# EAGLE design Tag PCB V1 (EAGLE 9.2.0)
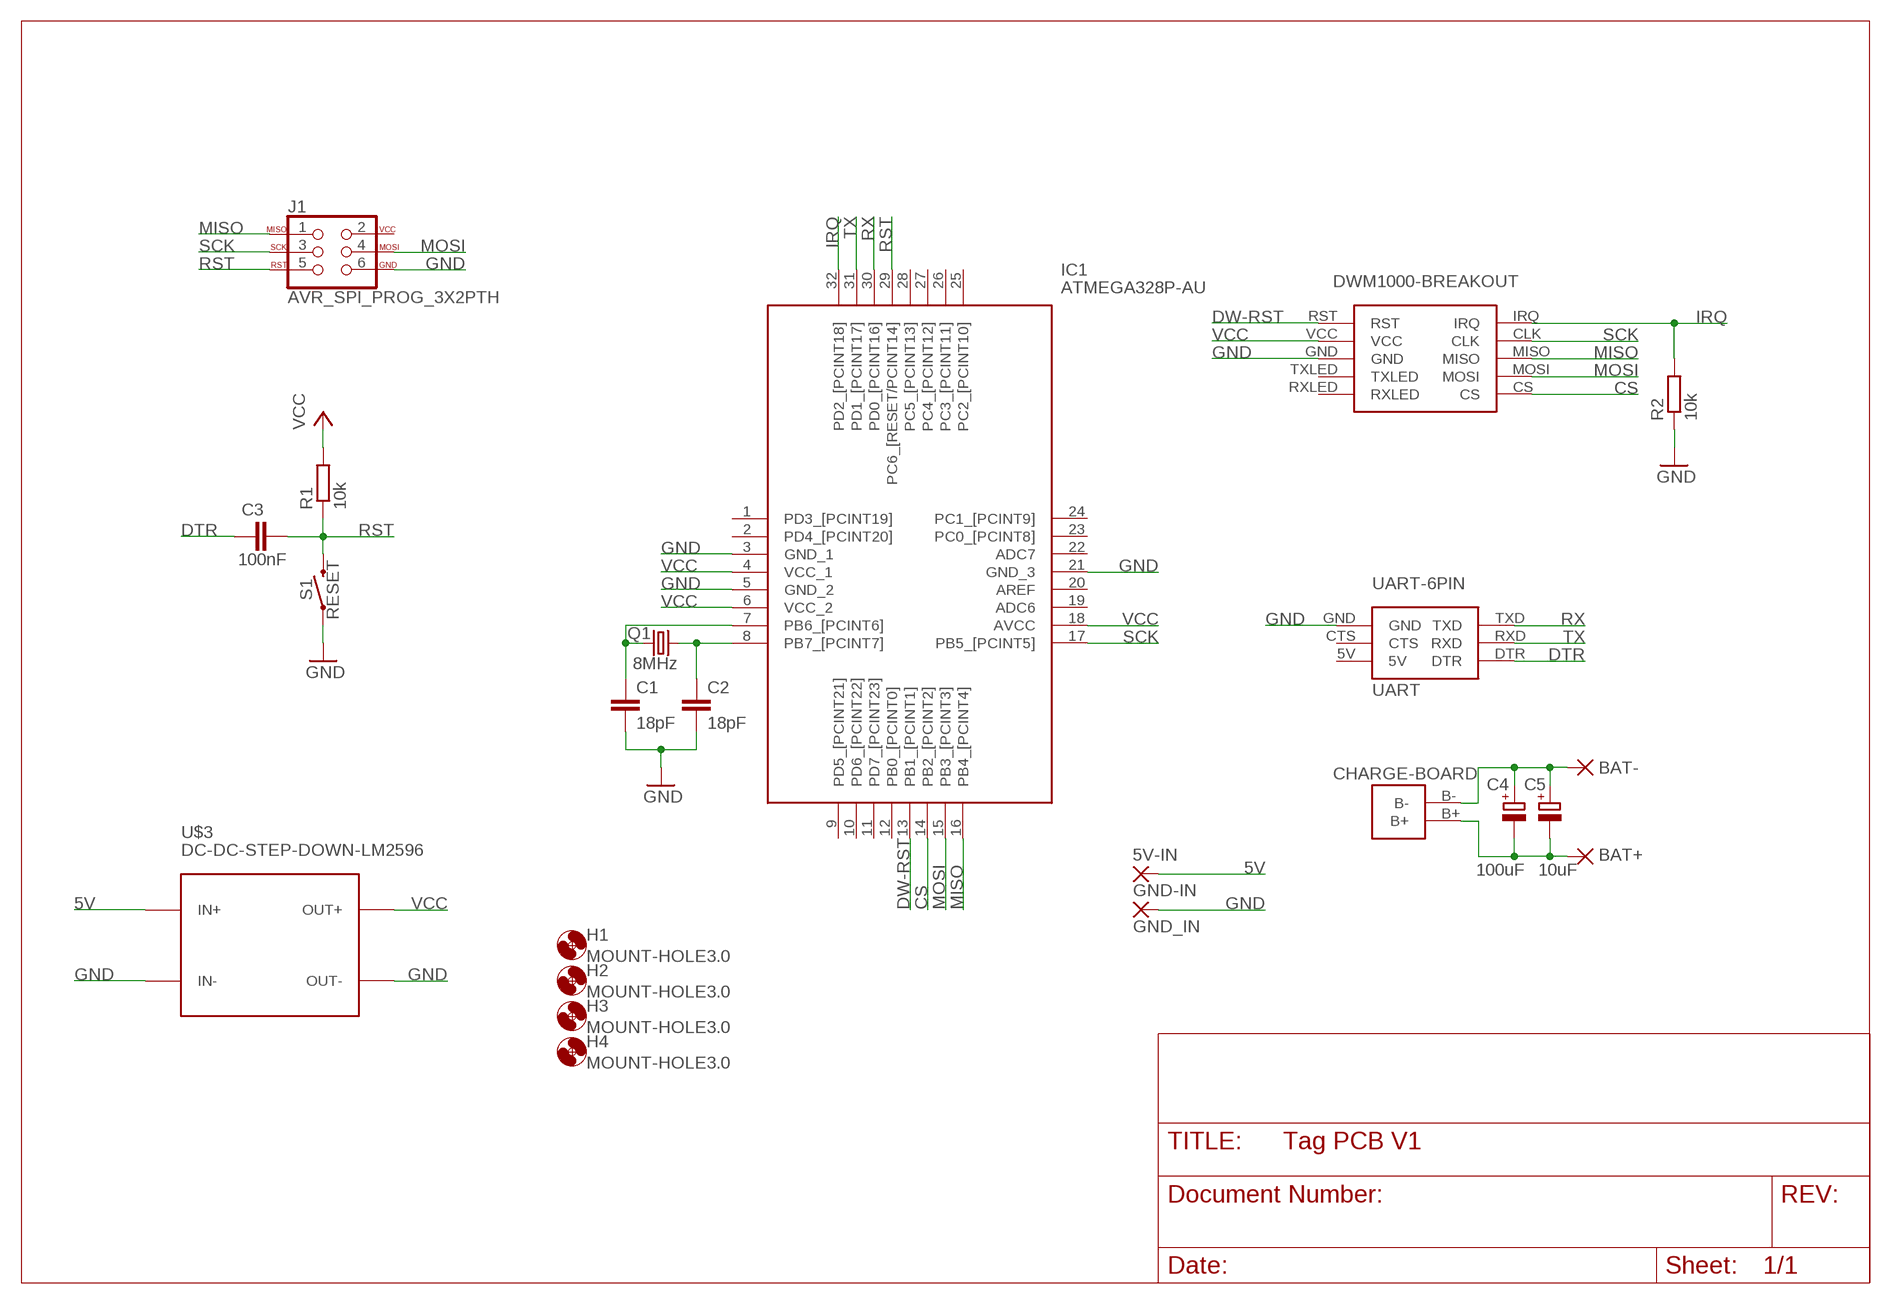
[diagram p0: schematic, sheet 1]

## Parts
5V-IN  2,15/1,0  [2,15/1,0]
BAT+  2,15/1,0  [2,15/1,0]
BAT-  2,15/1,0  [2,15/1,0]
C1  18pF  C-EUC0805  [C0805]
C2  18pF  C-EUC0805  [C0805]
C3  100nF  C-EUC0805  [C0805]
C4  100uF  CPOL-EUE3.5-8  [E3,5-8]
C5  10uF  CPOL-EUE2.5-7  [E2,5-7]
GND-IN  GND_IN  2,15/1,0  [2,15/1,0]
H1  MOUNT-HOLE3.0  [3,0]
H2  MOUNT-HOLE3.0  [3,0]
H3  MOUNT-HOLE3.0  [3,0]
H4  MOUNT-HOLE3.0  [3,0]
IC1  ATMEGA328P-AU  [QFP80P900X900X120-32N]
J1  AVR_SPI_PROG_3X2PTH  [2X3]
Q1  8MHz  CRYSTALHC49UP  [HC49UP]
R1  10k  R-EU_R0805  [R0805]
R2  10k  R-EU_R0805  [R0805]
S1  RESET  MOMENTARY-SWITCH-SPST-PTH-6.0MM  [TACTILE_SWITCH_PTH_6.0MM]
U$1  DWM1000-BREAKOUT  [DWM1000-BREAKOUT]
U$2  UART-6PIN  [UART-6PIN]
U$3  DC-DC-STEP-DOWN-LM2596  [DC-DC-STEP-DOWN-LM2596]
U$4  18650-CHARGE-5V-OUT  [18650-CHARGE-5V-OUT]

## Nets
5V: 5V-IN.1(P) U$3.IN+
CS: IC1.14(PB2_[PCINT2]) U$1.CS
DTR: C3.1 U$2.DTR
DW-RST: IC1.13(PB1_[PCINT1]) U$1.RST
GND: C1.2 C2.2 GND-IN.1(P) IC1.3(GND_1) IC1.5(GND_2) IC1.21(GND_3) J1.6 R2.1 S1.1 U$1.GND U$2.GND U$3.IN- U$3.OUT-
IRQ: IC1.32(PD2_[PCINT18]) R2.2 U$1.IRQ
MISO: IC1.16(PB4_[PCINT4]) J1.1 U$1.MISO
MOSI: IC1.15(PB3_[PCINT3]) J1.4 U$1.MOSI
N$1: BAT-.1(P) C4.+ C5.+ U$4.B-
N$2: BAT+.1(P) C4.- C5.- U$4.B+
N$5: C2.1 IC1.8(PB7_[PCINT7]) Q1.2
N$6: C1.1 IC1.7(PB6_[PCINT6]) Q1.1
RST: C3.2 IC1.29(PC6_[RESET/PCINT14]) J1.5 R1.1 S1.3
RX: IC1.30(PD0_[PCINT16]) U$2.TXD
SCK: IC1.17(PB5_[PCINT5]) J1.3 U$1.CLK
TX: IC1.31(PD1_[PCINT17]) U$2.RXD
VCC: IC1.4(VCC_1) IC1.6(VCC_2) IC1.18(AVCC) R1.2 U$1.VCC U$3.OUT+
Unconnected: IC1.1(PD3_[PCINT19]) IC1.2(PD4_[PCINT20]) IC1.9(PD5_[PCINT21]) IC1.10(PD6_[PCINT22]) IC1.11(PD7_[PCINT23]) IC1.12(PB0_[PCINT0]) IC1.19(ADC6) IC1.20(AREF) IC1.22(ADC7) IC1.23(PC0_[PCINT8]) IC1.24(PC1_[PCINT9]) IC1.25(PC2_[PCINT10]) IC1.26(PC3_[PCINT11]) IC1.27(PC4_[PCINT12]) IC1.28(PC5_[PCINT13]) J1.2 U$1.RXLED U$1.TXLED U$2.5V U$2.CTS

## Notes on the sheet
- CHARGE-BOARD

## Library data of the parts
5V-IN BAT+ BAT- GND-IN = wirepad:2,15/1,0: THROUGH-HOLE PAD
C1-C3 = rcl:C-EU: CAPACITOR, European symbol; SPICEPREFIX: C
C4 C5 = rcl:CPOL-EU: POLARIZED CAPACITOR, European symbol; SPICEPREFIX: C
H1-H4 = holes:MOUNT-HOLE: MOUNTING HOLE with drill center marker
IC1 = ATMEGA328P-AU:ATMEGA328P-AU: MICROCHIP - ATMEGA328P-AU. - MICROCONTROLLER MCU, 8 BIT, ATMEGA, 20MHZ, TQFP-32 Source: Datasheet <https://componentsearchengine.com/Datasheets/2/ATMEGA328P-AU.pdf>; ARROW_PART_NUMBER: ATMEGA328P-AU; ARROW_PRICE-STOCK: https://www.arrow.com/en/products/atmega328p-au/microchip-technology; DESCRIPTION: MICROCHIP - ATMEGA328P-AU. - MICROCONTROLLER MCU, 8 BIT, ATMEGA, 20MHZ, TQFP-32; HEIGHT: 1.2mm; MANUFACTURER_NAME: Microchip; MANUFACTURER_PART_NUMBER: ATMEGA328P-AU; RS_PART_NUMBER: 1310271; RS_PRICE-STOCK: http://uk.rs-online.com/web/p/products/1310271
J1 = SparkFun-Connectors:AVR_SPI_PROG_3X2: AVR ISP 6 Pin This is the reduced ISP connector for AVR programming. Common on Arduino. This footprint will take up less PCB space and can be used with a 10-pin to 6-pin adapter such as SKU: BOB-08508 **Special note about "TEST_POINT" package. The stop mask is on the top side, so if you want your programming test points to be on the bottom of your board, make sure to place this package on the bottom side of the board. This also ensure that the orientation to program from the bottom side will be correct. SparkFun Products: SparkFun ISP Pogo Adapter <https://www.sparkfun.com/products/11591> - NS Tiny AVR Programmer <https://www.sparkfun.com/products/11801> -PTH
Q1 = crystal:CRYSTAL: CRYSTAL; OC_FARNELL: unknown; OC_NEWARK: unknown
R1 R2 = rcl:R-EU_: RESISTOR, European symbol; SPICEPREFIX: R
S1 = SparkFun-Switches:MOMENTARY-SWITCH-SPST: Momentary Switch (Pushbutton) - SPST Normally-open (NO) SPST momentary switches (buttons, pushbuttons). Variants PTH-12MM - 12mm square, through-hole Momentary Pushbutton Switch - 12mm Square <https://www.sparkfun.com/products/9190> (COM-09190) PTH-6.0MM, PTH-6.0MM-KIT - 6.0mm square, through-hole Mini Pushbutton Switch <https://www.sparkfun.com/products/97> (COM-00097) KIT package intended for soldering kit's - only one side of pads' copper is exposed. PTH-RIGHT-ANGLE-KIT - Right-angle, through-hole Right Angle Tactile Button <https://www.sparkfun.com/products/10791> - Used on SparkFun BigTime Watch Kit <https://www.sparkfun.com/products/11734> SMD-12MM - 12mm square, surface-mount Tactile Button - SMD (12mm) <https://www.sparkfun.com/products/12993> (COM-12993) Used on SparkFun PicoBoard <https://www.sparkfun.com/products/11888> SMD-4.5MM - 4.5mm Square Trackball Switch Used on SparkFun Blackberry Trackballer Breakout <https://www.sparkfun.com/products/13169> SMD-4.6MMX2.8MM - 4.60mm x 2.80mm, surface mount Used on SparkFun SAMD21 Mini Breakout <https://www.sparkfun.com/products/13664> SMD-5.2MM, SMD-5.2-REDUNDANT - 5.2mm square, surface-mount Mini Pushbutton Switch - SMD <https://www.sparkfun.com/products/8720> (COM-08720) Used on Arduino Pro Mini <https://www.sparkfun.com/products/11114> REDUNDANT package connects both switch circuits together SMD-6.0X3.5MM - 6.0 x 3.5mm, surface mount Momentary Reset Switch SMD <https://www.sparkfun.com/products/8229> (COM-08229) SMD-6.2MM-TALL - 6.2mm square, surface mount Tactile Button - SMD (6mm) <https://www.sparkfun.com/products/12992> Used on SparkFun Digital Sandbox <https://www.sparkfun.com/products/12651> SMD-RIGHT-ANGLE - Right-angle, surface mount Used on SparkFun Block for Intel® Edison - Arduino <https://www.sparkfun.com/products/13036>; PROD_ID: SWCH-08441; SF_SKU: COM-00097
U$1 = Eigen Library:DWM1000-BREAKOUT
U$2 = Eigen Library:UART-6PIN
U$3 = 1484249208697-powermodules:DC-DC-STEP-DOWN-LM2596: DC/DC Step-Down Regulator based on LM2596-ADJ chip
U$4 = Eigen Library:18650-CHARGE-5V-OUT

## Board
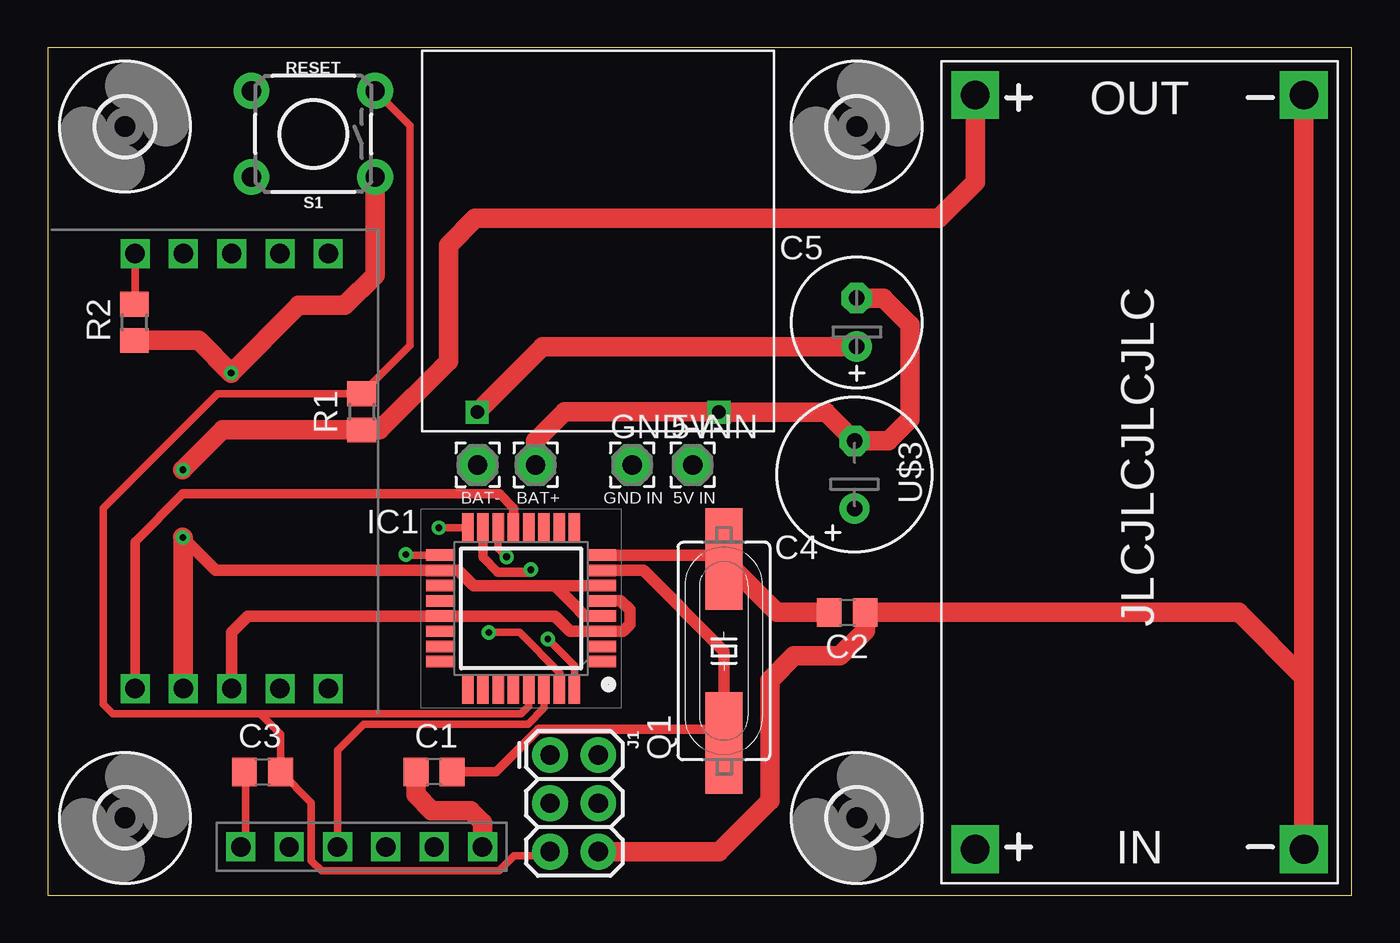
[diagram p1: board, top side]
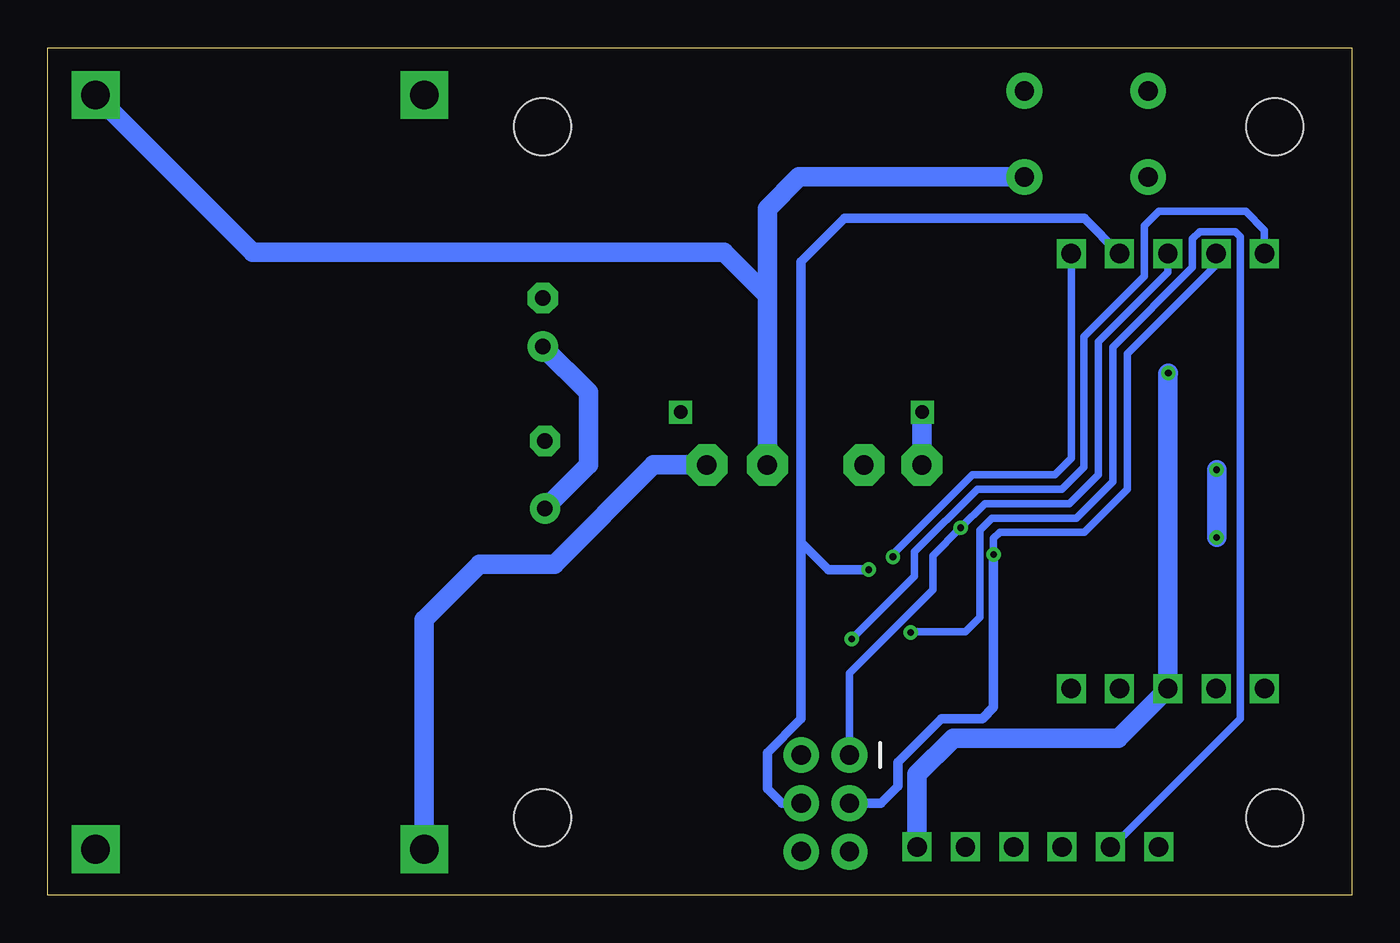
[diagram p2: board, bottom side, seen from below]

Size 68.57 x 44.54 mm. Coordinates in mm from the lower left corner, seen from the top.
Outline: 0,0 68.57,0 68.57,44.54 0,44.54 0,0
Copper layers (1*16): Top 0.035mm / dielectric 1.5mm / Bottom 0.035mm
Design rules "default *": minimum track width 15mil, minimum drill 0.35mm, track to track 6mil, track to pad 6mil, pad to pad 6mil, via to via 6mil, smd to smd 6mil, copper to edge 40mil, drill to drill 6mil, minimum pad ring 10mil, minimum via ring 8mil, stop-mask expansion 4mil, vias tented up to drill 0mil, thermal gap 10mil

### Footprints (pad centres in the part's own frame; a part is rotated, then mirrored left to right if it is on the bottom)
2,15/1,0 = drill 1.016 pad 2.159 octagon: 1 0,0
C0805 = smd 1.3 x 1.5: 1 -0.95,0; 2 0.95,0
E3,5-8 = drill 0.813 pad 1.6: + -1.778,0 | drill 0.813 pad 1.6 octagon: - 1.778,0
E2,5-7 = drill 0.813 pad 1.6: + -1.27,0 | drill 0.813 pad 1.6 octagon: - 1.27,0
3,0 = hole 3: 0,0
QFP80P900X900X120-32N = smd 1.5 x 0.6: 1 -4.25,2.8; 2 -4.25,2; 3 -4.25,1.2; 4 -4.25,0.4; 5 -4.25,-0.4; 6 -4.25,-1.2; 7 -4.25,-2; 8 -4.25,-2.8; 17 4.25,-2.8; 18 4.25,-2; 19 4.25,-1.2; 20 4.25,-0.4; 21 4.25,0.4; 22 4.25,1.2; 23 4.25,2; 24 4.25,2.8 | smd 0.6 x 1.5: 9 -2.8,-4.25; 10 -2,-4.25; 11 -1.2,-4.25; 12 -0.4,-4.25; 13 0.4,-4.25; 14 1.2,-4.25; 15 2,-4.25; 16 2.8,-4.25; 25 2.8,4.25; 26 2,4.25; 27 1.2,4.25; 28 0.4,4.25; 29 -0.4,4.25; 30 -1.2,4.25; 31 -2,4.25; 32 -2.8,4.25
2X3 = drill 1.016 pad 1.88: 1 0,0; 2 0,2.54; 3 2.54,0; 4 2.54,2.54; 5 5.08,0; 6 5.08,2.54
HC49UP = smd 5.334 x 1.93: 1 -4.826,0; 2 4.826,0
R0805 = smd 1.3 x 1.5: 1 -0.95,0; 2 0.95,0
TACTILE_SWITCH_PTH_6.0MM = drill 1.016 pad 1.88: 1 -3.251,2.261; 2 3.251,2.261; 3 -3.251,-2.261; 4 3.251,-2.261
DWM1000-BREAKOUT = drill 1.02 pad 1.5 square: CLK 11.444,-3.328; CS 11.444,-10.948; GND -11.416,-5.868; IRQ 11.444,-0.788; MISO 11.444,-5.868; MOSI 11.444,-8.408; RST -11.416,-0.788; RXLED -11.416,-10.948; TXLED -11.416,-8.408; VCC -11.416,-3.328
UART-6PIN = drill 1.02 pad 1.5 square: 5V 5.08,0; CTS 2.54,0; DTR 12.7,0; GND 0,0; RXD 10.16,0; TXD 7.62,0
DC-DC-STEP-DOWN-LM2596 = drill 1.5 pad 2.5 square: IN+ -19.812,8.636; IN- -19.812,-8.636; OUT+ 19.812,8.636; OUT- 19.812,-8.636
18650-CHARGE-5V-OUT = drill 0.7 square: B+ 15.6,1; B- 2.9,1

### Placement (x,y rotation side)
5V-IN  33.91,22.61 0 top
BAT+  25.65,22.61 0 top
BAT-  22.61,22.61 0 top
C1  20.32,6.48 180 top
C2  42.04,14.86 0 top
C3  11.3,6.48 0 top
C4  42.42,22.1 90 top
C5  42.55,30.1 90 top
GND-IN  30.73,22.61 0 top
H1  4.06,4.06 0 top
H2  4.06,40.39 0 top
H3  42.55,4.06 0 top
H4  42.55,40.39 0 top
IC1  24.89,15.07 180 top
J1  26.42,7.37 270 top
Q1  35.56,12.83 90 top
R1  16.51,25.4 270 top
R2  4.57,30.1 90 top
S1  13.97,40.01 180 top
U$1  3.81,22.27 90 top
U$2  22.86,2.54 180 top
U$3  57.4,22.23 90 top
U$4  19.68,24.38 0 top

### Tracks (layer width: path | path; a pad name or v marks a point on that pad's centre or on a via)
5V
  Bottom 1.016: 5V-IN.1 36.7,22.61 41.91,17.4 45.85,17.4 48.77,14.48 U$3.IN+
CS  (via drill 0.35)
  Top 0.381: IC1.14 23.69,18.22 v24.13,17.78
  Bottom 0.381: U$1.CS 14.76,22.96 15.62,22.1 19.94,22.1 24.13,17.91 v24.13,17.78
DTR
  Top 0.381: C3.1 10.4,6.34 10.4,2.6 U$2.DTR
DW-RST
  Top 0.508: U$1.RST 4.6,18.57 7.11,21.08 23.75,21.08 24.49,20.34 IC1.13
GND  (via drill 0.35)
  Top 0.61: U$1.GND 9.68,13.82 10.53,14.67 IC1.21 26.67,14.67 27.47,13.87 IC1.3 30.25,13.87 30.61,14.22 30.61,14.99 30.12,15.47 IC1.5
  Top 1.016: U$3.OUT- 66.04,11.43 | 66.04,11.43 U$3.IN- | 66.04,11.43 62.61,14.86 C2.2 42.99,13.9 41.66,12.57 39.24,12.57 37.97,11.3 37.97,4.95 35.31,2.29 J1.6 | C1.2 19.37,5.27 20.19,4.45 22.23,4.45 22.86,3.81 U$2.GND | S1.1 17.22,32.59 15.62,30.99 13.21,30.99 v9.65,27.43 7.93,29.15 R2.1
  Bottom 1.016: U$2.GND 22.86,6.35 20.95,8.26 12.28,8.26 U$1.GND 9.68,27.41 v9.65,27.43 | U$3.OUT- 57.78,33.78 33.02,33.78 30.73,31.5 | 30.73,31.5 GND-IN.1 | S1.1 29.06,37.74 30.73,36.07 30.73,31.5
IRQ  (via drill 0.35)
  Top 0.381: R2.2 4.53,31.14 4.6,31.2 U$1.IRQ | IC1.32 27.69,12.06 v26.29,13.46
  Bottom 0.381: U$1.IRQ 4.6,34.95 5.59,35.94 10.16,35.94 10.92,35.18 10.92,32.51 14.1,29.34 14.1,22.48 15.24,21.34 19.68,21.34 22.99,18.03 22.99,16.76 v26.29,13.46
MISO  (via drill 0.35)
  Top 0.381: IC1.16 20.59,19.32 v20.57,19.3
  Bottom 0.381: J1.1 26.4,7.4 26.4,11.67 22.03,16.04 22.03,17.84 v20.57,19.3 19.3,20.57 14.86,20.57 13.34,22.1 13.34,29.08 9.68,32.74 U$1.MISO
MOSI  (via drill 0.35)
  Top 0.508: IC1.15 22.89,17.75 23.66,16.98 25.28,16.98 v25.4,17.1
  Bottom 0.508: J1.4 29.97,4.83 30.73,5.59 30.73,7.49 28.96,9.27 28.96,18.54 | U$1.MOSI 14.06,35.56 26.67,35.56 28.96,33.27 28.96,18.54 | v25.4,17.1 27.52,17.1 28.96,18.54
N$1
  Top 1.016: U$4.B- 26.03,28.83 C5.+
  Bottom 1.016: BAT-.1 22.61,25.36 U$4.B- | C5.+ 40.13,26.42 40.13,22.61 C4.+
N$2
  Top 1.016: BAT+.1 25.65,23.88 27.18,25.4 35.27,25.4 U$4.B+ 40.91,25.38 C4.- 44.2,23.88 45.34,25.02 45.34,29.97 43.94,31.37 C5.-
N$5
  Top 0.61: IC1.8 35.34,17.87 Q1.2
  Top 1.016: C2.1 38.35,14.86 Q1.2
N$6
  Top 0.508: C1.1 23.58,6.48 25.81,8.71 34.85,8.71 Q1.1
  Top 0.61: IC1.7 31.32,17.07 35.56,12.83 Q1.1
RST
  Top 0.381: J1.5 26.4,2.07 24.54,2.07 23.74,1.27 14.4,1.27 13.87,1.8 13.87,4.86 C3.2 12.25,8.44 11.17,9.53 | 11.17,9.53 3.43,9.53 2.93,10.02 2.93,20.33 8.95,26.35 R1.1 19.05,28.89 19.05,40.44 S1.3 | IC1.29 25.29,9.93 24.89,9.53 11.17,9.53
RX
  Top 0.381: U$2.TXD 15.24,7.62 16.61,8.99 25.25,8.99 26.1,9.84 IC1.30
SCK  (via drill 0.35)
  Top 0.381: IC1.17 18.87,17.87 v18.84,17.9
  Bottom 0.381: U$1.CLK 7.14,33.12 11.81,28.45 11.81,21.34 14.07,19.07 18.52,19.07 18.84,18.75 v18.84,17.9
  Bottom 0.508: J1.3 24.77,4.83 23.88,5.71 23.88,6.99 21.59,9.27 19.43,9.27 18.84,9.87 v18.84,17.9
TX  (via drill 0.35)
  Top 0.381: v23.2,13.8 24.8,13.8 26.94,11.67 26.94,10.87 IC1.31
  Bottom 0.381: U$2.RXD 12.54,2.6 5.87,9.27 5.87,34.61 6.13,34.87 8,34.87 8.38,34.49 8.38,32.99 12.57,28.8 12.57,21.72 14.48,19.81 18.92,19.81 19.56,19.18 19.56,14.61 20.32,13.84 23.16,13.84 v23.2,13.8
VCC  (via drill 0.35)
  Top 0.61: 26.67,16.27 22.39,16.27 21.59,17.07 IC1.18 8.84,17.07 v7.11,18.8 | IC1.6 26.67,16.27 | 26.67,16.27 27.93,15 27.93,14.98 28.25,14.67 IC1.4
  Top 1.016: U$1.VCC 7.14,18.77 v7.11,18.8 | v7.11,22.35 9.21,24.45 R1.2 17.46,24.45 21.08,28.07 21.08,34.16 22.48,35.56 46.86,35.56 48.77,37.47 U$3.OUT+
  Bottom 1.016: v7.11,22.35 v7.11,18.8

### Text on the board
tNames: GND IN | 5V IN | JLCJLCJLCJLC